# EasyEDA Pro project Simple Extension.epro

# Schematic Schematic1

## Sheets
1 P1: Board Name: Board1; Create Date: 2026-04-10; Page Name: P1; Project Name: Simple Extension; Schematic Name: Schematic1; Update Date: 2026-04-15; Company: EasyEDA.com; Page Size: A4; Version: V1.0
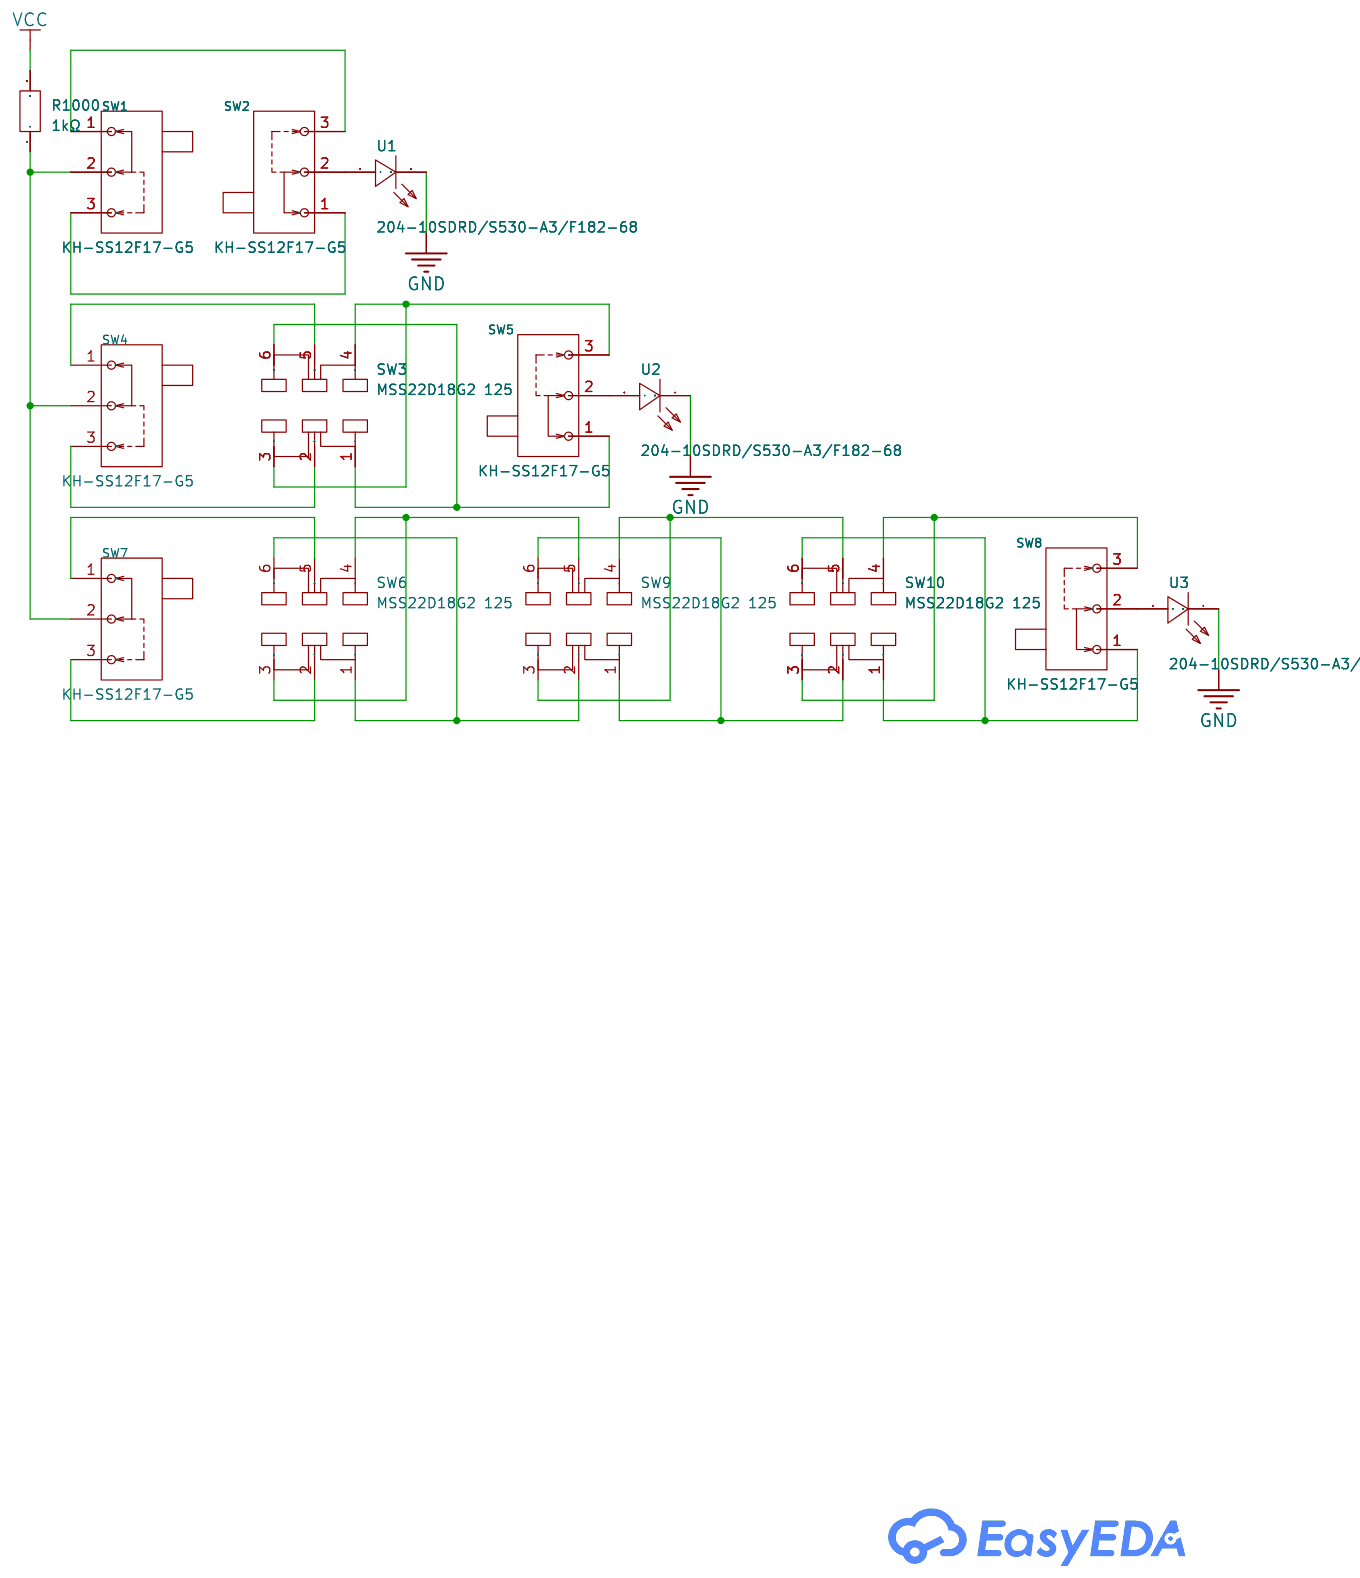
[diagram p0: P1]
2 P2: Page Name: P2; Update Date: 2026-04-11
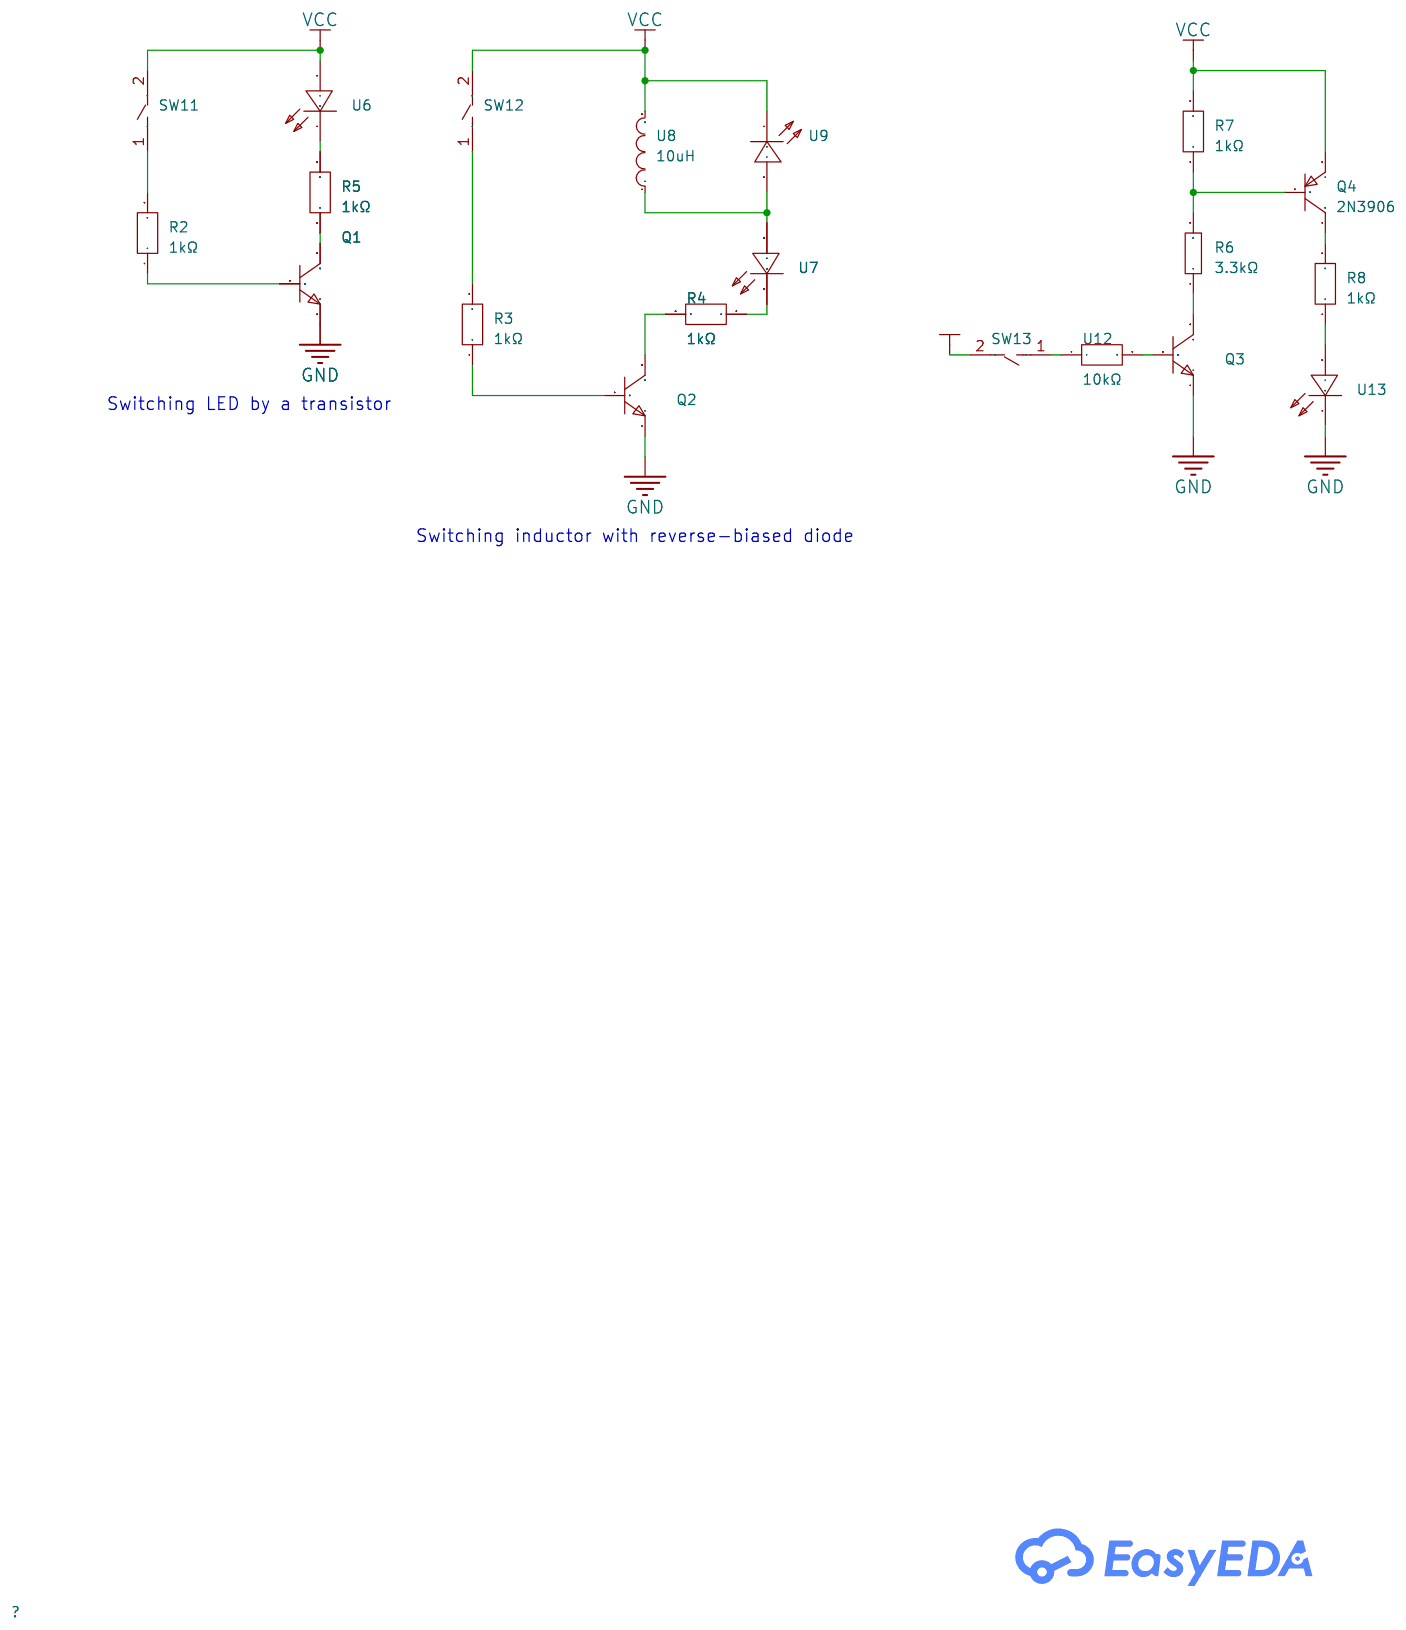
[diagram p1: P2]
3 Voltage I/O: Create Date: 2026-04-15; Page Name: Voltage I/O; Update Date: 2026-04-16
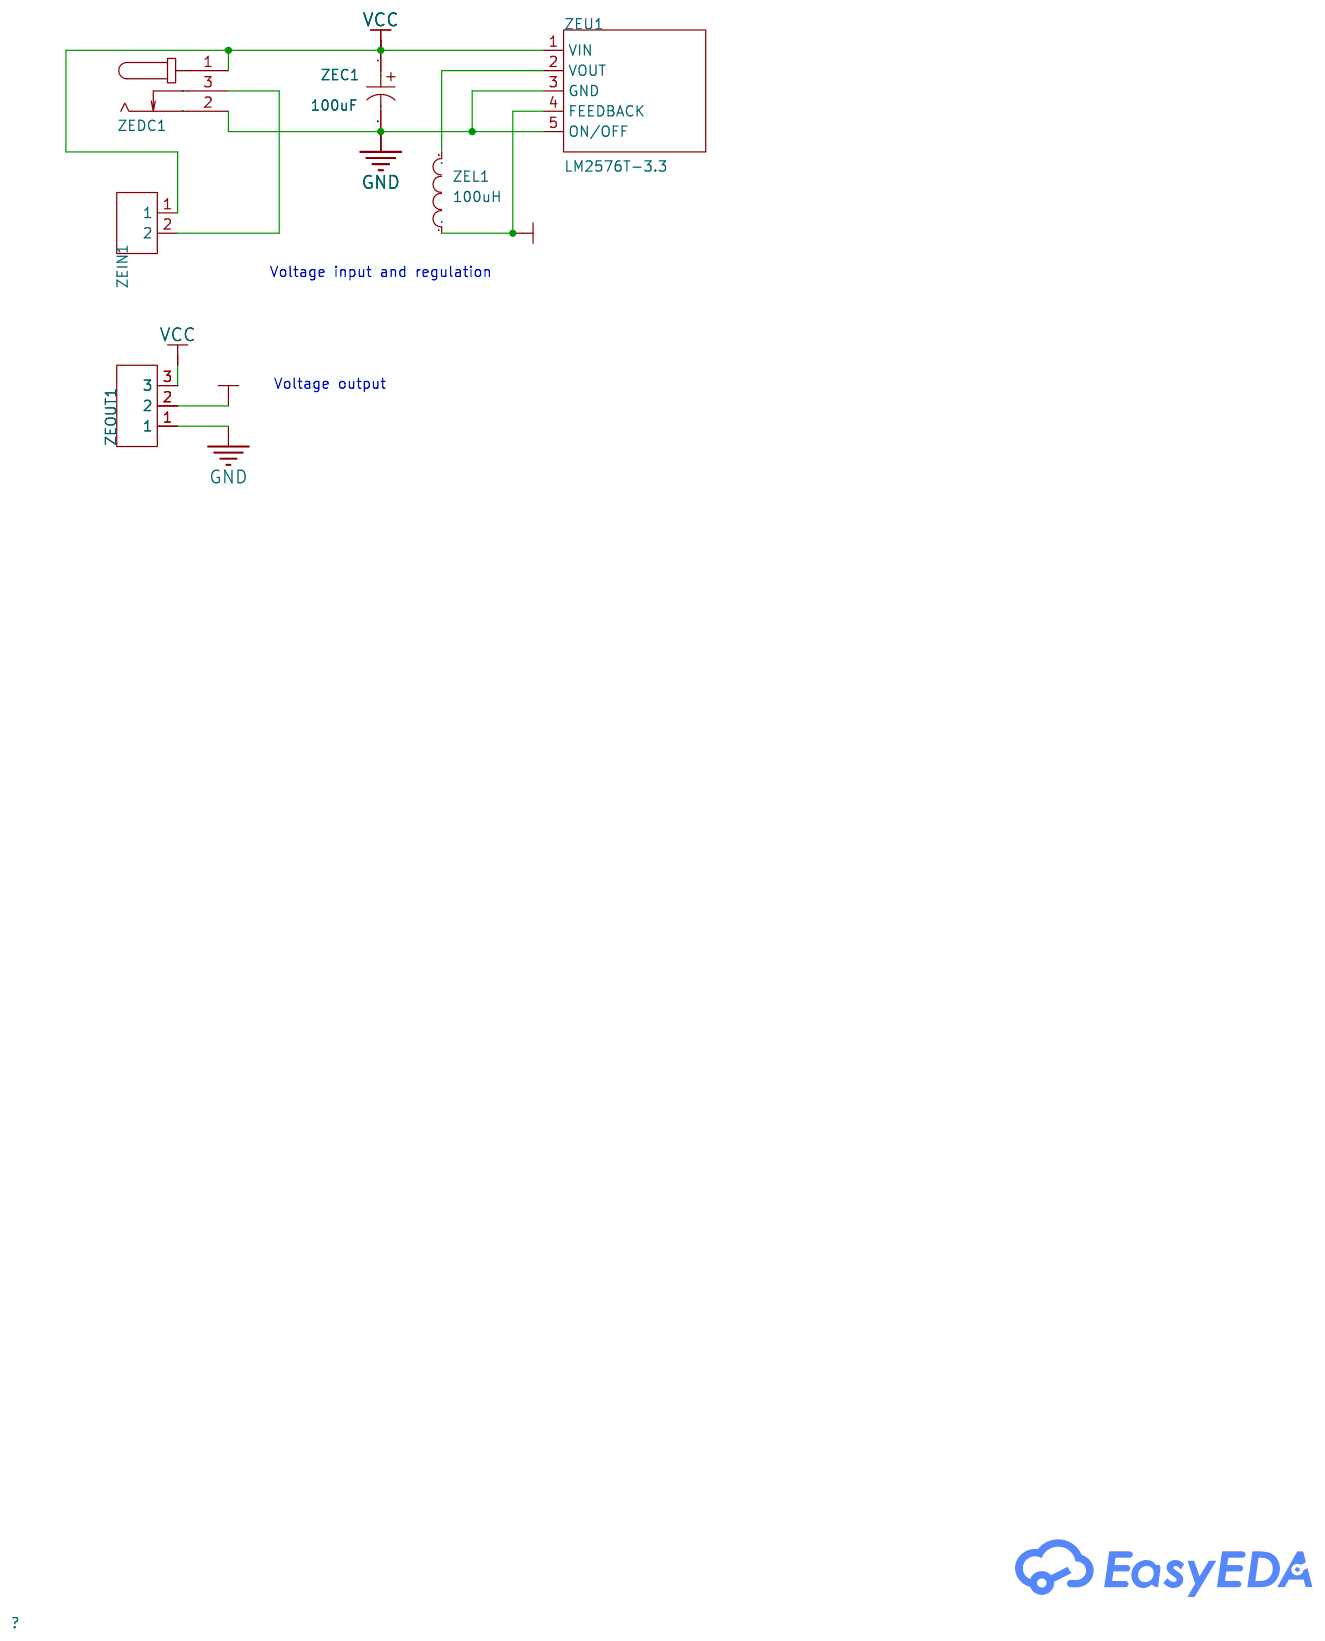
[diagram p2: Voltage I/O]
4 Resistance: Create Date: 2026-04-15; Page Name: Resistance; Update Date: 2026-04-16
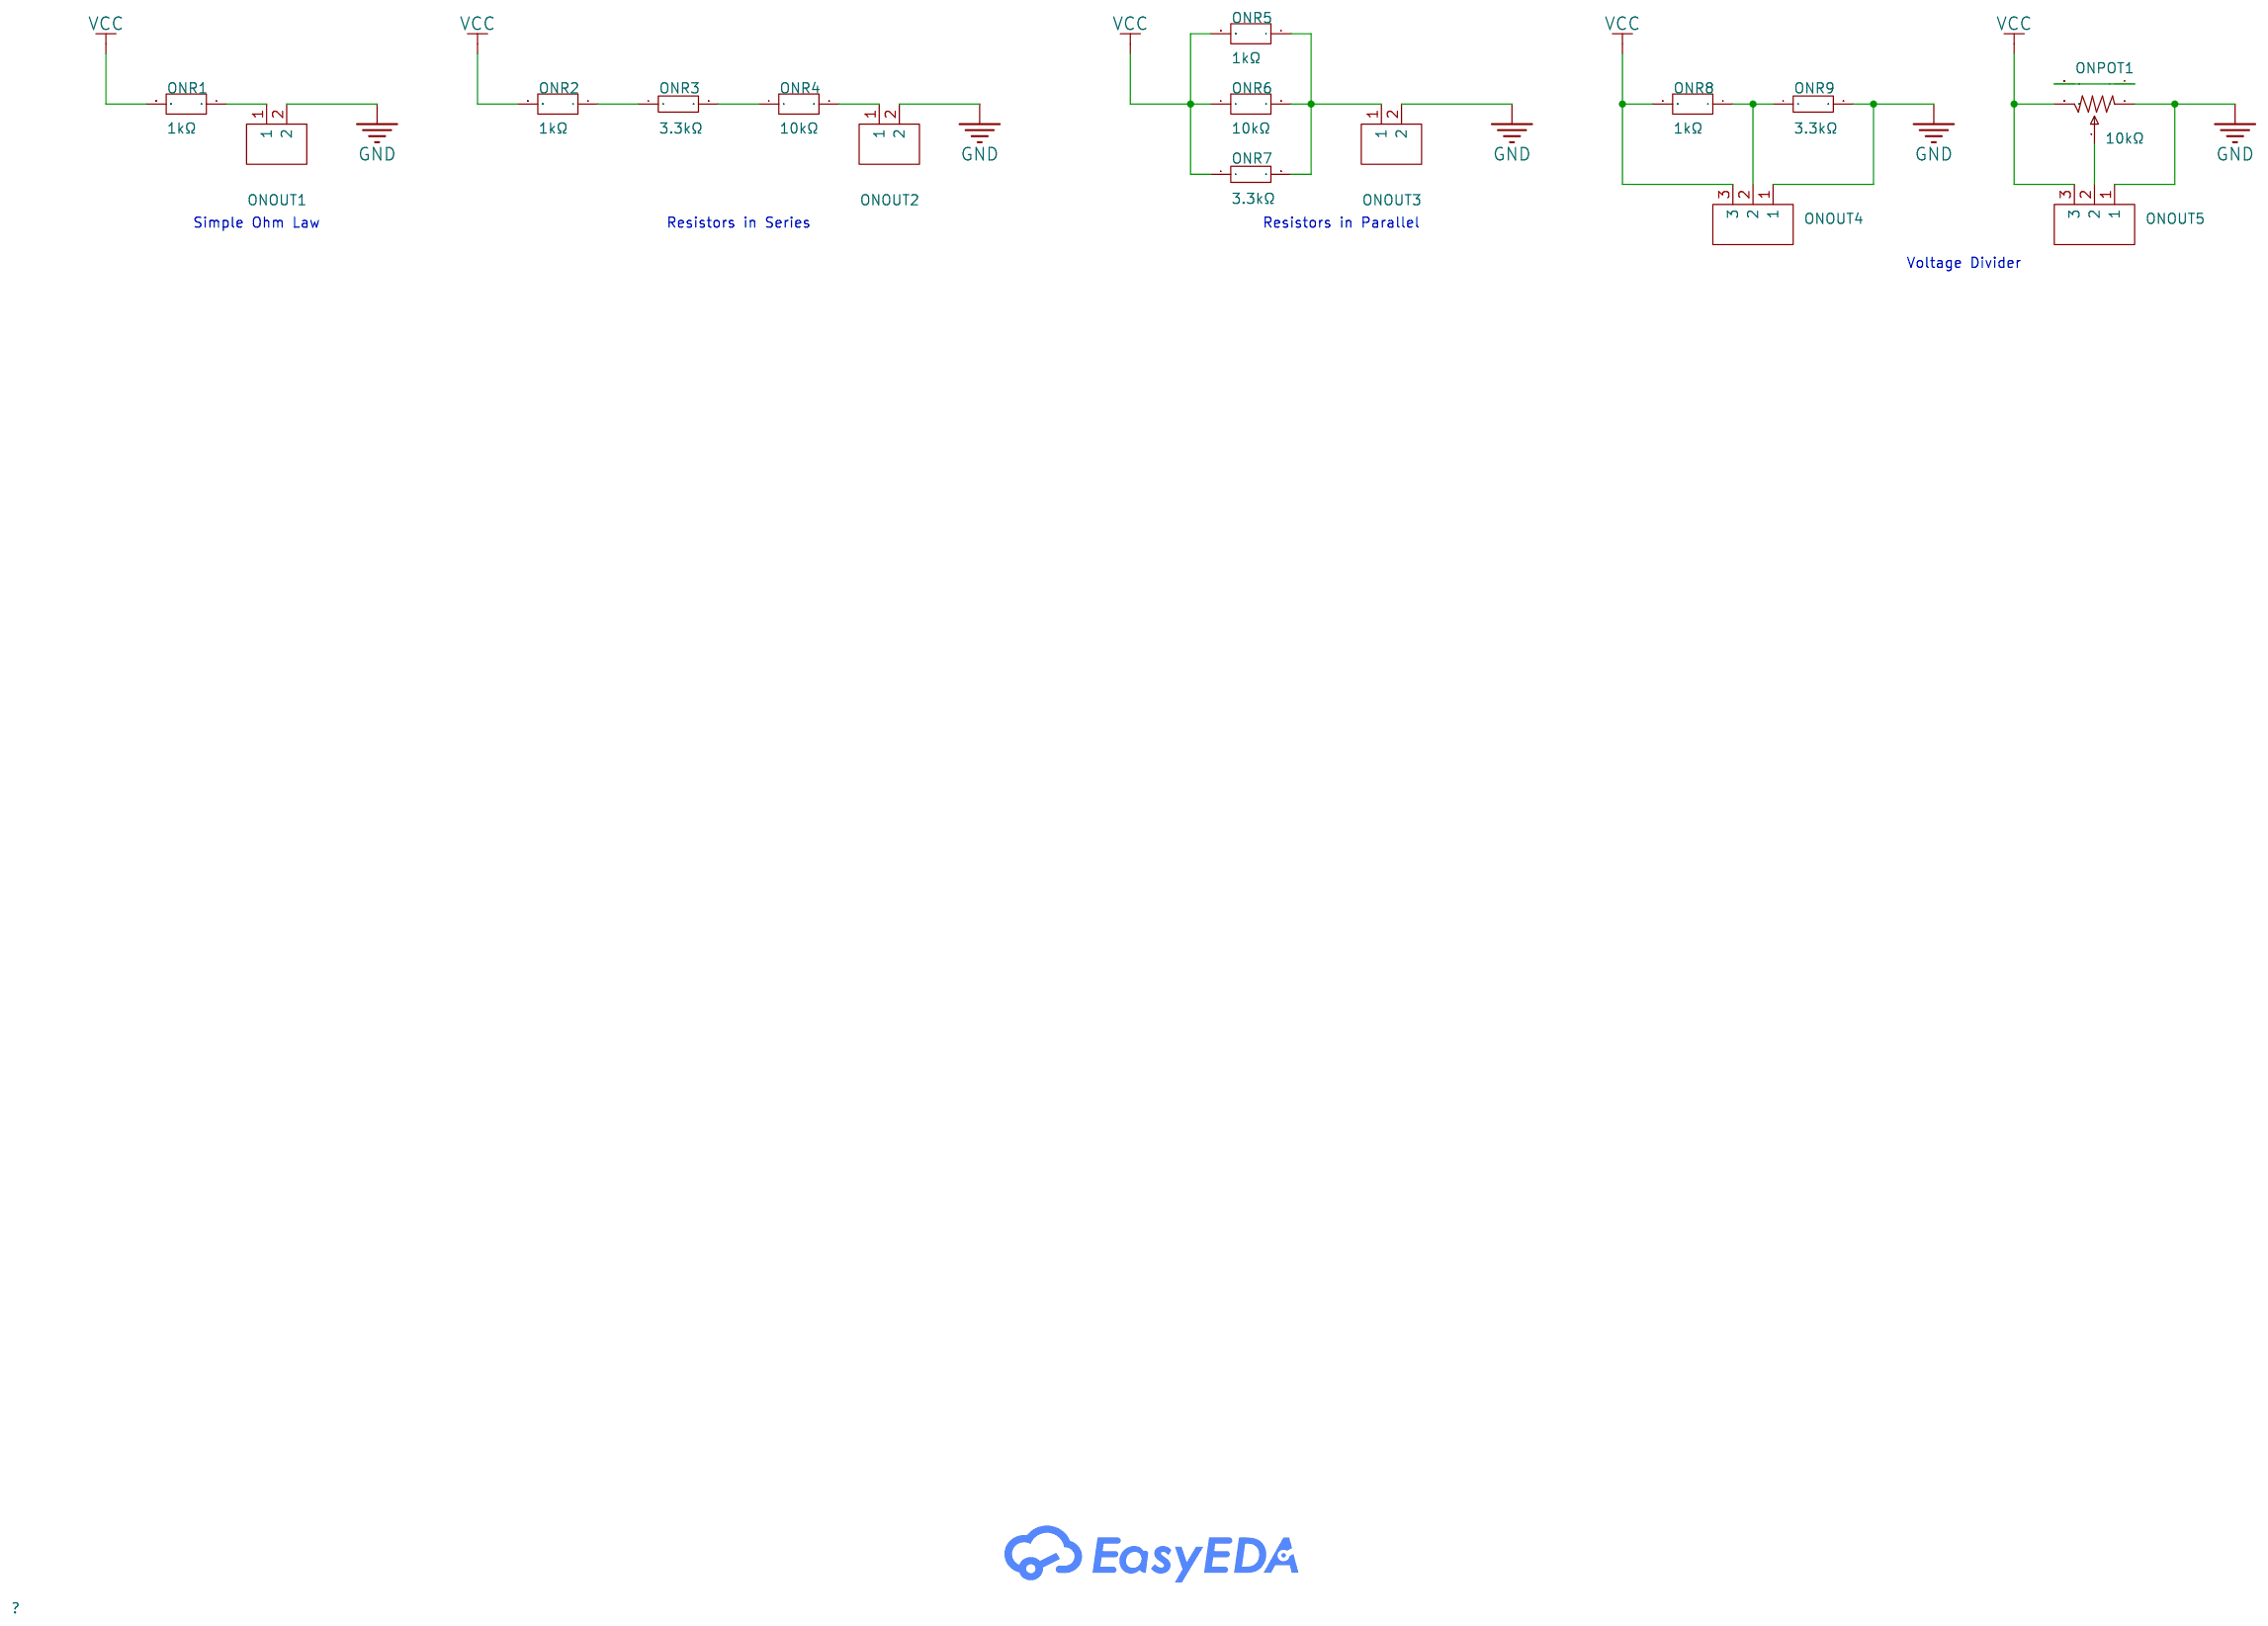
[diagram p3: Resistance]

## Parts
sheet P1
R1000  1kΩ  [RES-TH_BD2.3-L3.7-P7.70-D0.9]
SW1  KH-SS12F17-G5  [SW-TH_KH-SS12F17-G5]
SW2  KH-SS12F17-G5  [SW-TH_KH-SS12F17-G5]
SW3  MSS22D18G2 125  [SW-TH_SHOU_MSS22D18G2]
SW4  KH-SS12F17-G5  [SW-TH_KH-SS12F17-G5]
SW5  KH-SS12F17-G5  [SW-TH_KH-SS12F17-G5]
SW6  MSS22D18G2 125  [SW-TH_SHOU_MSS22D18G2]
SW7  KH-SS12F17-G5  [SW-TH_KH-SS12F17-G5]
SW8  KH-SS12F17-G5  [SW-TH_KH-SS12F17-G5]
SW9  MSS22D18G2 125  [SW-TH_SHOU_MSS22D18G2]
SW10  MSS22D18G2 125  [SW-TH_SHOU_MSS22D18G2]
U1  204-10SDRD/S530-A3/F182-68  [LED-TH_BD4.0-P2.50-RD]
U2  204-10SDRD/S530-A3/F182-68  [LED-TH_BD4.0-P2.50-RD]
U3  204-10SDRD/S530-A3/F182-68  [LED-TH_BD4.0-P2.50-RD]
sheet P2
Q1  2N4401052  [TO-92-3_L4.9-W3.7-P1.27-L]
Q2  2N4401052  [TO-92-3_L4.9-W3.7-P1.27-L]
Q3  2N4401052  [TO-92-3_L4.9-W3.7-P1.27-L]
Q4  2N3906  [TO-92-3_L4.8-W3.7-P1.27-R-1]
R2  1kΩ  [RES-TH_BD2.3-L3.7-P7.70-D0.9]
R3  1kΩ  [RES-TH_BD2.3-L3.7-P7.70-D0.9]
R4  1kΩ  [RES-TH_BD2.3-L3.7-P7.70-D0.9]
R5  1kΩ  [RES-TH_BD2.3-L3.7-P7.70-D0.9]
R6  3.3kΩ  [RES-TH_BD2.3-L6.5-P10.50-D0.5]
R7  1kΩ  [RES-TH_BD2.3-L3.7-P7.70-D0.9]
R8  1kΩ  [RES-TH_BD2.3-L3.7-P7.70-D0.9]
SW11  TSA36111-050D331DE  [SW-TH_L6.0-W3.5-P6.50]
SW12  TSA36111-050D331DE  [SW-TH_L6.0-W3.5-P6.50]
SW13  TSA36111-050D331DE  [SW-TH_L6.0-W3.5-P6.50]
U6  204-10SDRD/S530-A3/F182-68  [LED-TH_BD4.0-P2.50-RD]
U7  204-10SDRD/S530-A3/F182-68  [LED-TH_BD4.0-P2.50-RD]
U8  10uH  [IND-TH_BD4.0-L10.5-P14.50-D0.6]
U9  204-10SDRD/S530-A3/F182-68  [LED-TH_BD4.0-P2.50-RD]
U12  10kΩ  [RES-TH_BD2.3-L6.3-P10.30-D0.6]
U13  204-10SDRD/S530-A3/F182-68  [LED-TH_BD4.0-P2.50-RD]
sheet Resistance
ONOUT1  PH2.54-1X2P-H25  [HDR-TH_2P-P2.54-V-M-4]
ONOUT2  PH2.54-1X2P-H25  [HDR-TH_2P-P2.54-V-M-4]
ONOUT3  PH2.54-1X2P-H25  [HDR-TH_2P-P2.54-V-M-4]
ONOUT4  PH2.54-01-03PZD  [HDR-TH_3P-P2.54-V-M]
ONOUT5  PH2.54-01-03PZD  [HDR-TH_3P-P2.54-V-M]
ONPOT1  10kΩ  [RES-ADJ-TH_RK09D1130C3C]
ONR1  1kΩ  [RES-TH_BD2.3-L3.7-P7.70-D0.9]
ONR2  1kΩ  [RES-TH_BD2.3-L3.7-P7.70-D0.9]
ONR3  3.3kΩ  [RES-TH_BD2.3-L6.5-P10.50-D0.5]
ONR4  10kΩ  [RES-TH_BD2.3-L6.3-P10.30-D0.6]
ONR5  1kΩ  [RES-TH_BD2.3-L3.7-P7.70-D0.9]
ONR6  10kΩ  [RES-TH_BD2.3-L6.3-P10.30-D0.6]
ONR7  3.3kΩ  [RES-TH_BD2.3-L6.5-P10.50-D0.5]
ONR8  1kΩ  [RES-TH_BD2.3-L3.7-P7.70-D0.9]
ONR9  3.3kΩ  [RES-TH_BD2.3-L6.5-P10.50-D0.5]
sheet Voltage I/O
ZEC1  100uF  [CAP-TH_BD6.0-P2.50-D0.5-FD]
ZEDC1  DC-005-2.5  [DC-IN-TH_DC-005-2.5_C9900097950]
ZEIN1  PH2.54-1X2P-H25  [HDR-TH_2P-P2.54-V-M-4]
ZEL1  100uH  [IND-TH_BD4.0-L11.0-P15.00-D0.6]
ZEOUT1  PH2.54-01-03PZD  [HDR-TH_3P-P2.54-V-M]
ZEU1  LM2576T-3.3  [TO-220-5L_L10.2-W4.5-P1.71-L]

## Library data of the parts
ONR1 ONR2 ONR5 ONR8 R2-R5 R7 R8 R1000 = CR1/8W-1K±5%-OT26: Type:Carbon Resister Resistance: Tolerance:±5% Tolerance:±5% Overload Voltage (Max):200V Power(Watts):125mW Temperature Coefficient:±350ppm/℃ Temperature Coefficient:±350ppm/℃ Operating Temperature Range:-55℃~+155℃ Operating Temperature Range:-55℃~+155℃; LCSC Part Name: 碳膜电阻 1kΩ ±5% 125mW; Supplier Part: C2896952; Manufacturer: VO(翔胜); Supplier Footprint: 插件,D2.3xL3.7mm; JLCPCB Part Class: Extended Part; Datasheet: https://atta.szlcsc.com/upload/public/pdf/source/20210803/C2857407_45FF53FE186CAB545115AD37303966CD.pdf; Supplier: LCSC; Type: Carbon Resister; Tolerance: ±5%; Overload Voltage (Max): 200V; Power(Watts): 125mW; Temperature Coefficient: ±350ppm/℃; Operating Temperature Range: -55℃~+155℃
SW1 SW2 SW4 SW5 SW7 SW8 = KH-SS12F17-G5: LCSC Part Name: 拨动开关 KH-SS12F17-G5; Supplier Part: C5274464; Manufacturer: kinghelm(金航标); Supplier Footprint: 插件; JLCPCB Part Class: Extended Part; Datasheet: https://atta.szlcsc.com/upload/public/pdf/source/20221118/A394A3D39A10FBA52FA26B90A9AAE8C2.pdf; Supplier: LCSC
SW3 SW6 SW9 SW10 = MSS22D18G2 125: Circuit:DPDT Termination Style:PC Pin Mounting Type:Through Hole Actuator Color:Black Current Rating:100mA Voltage Rating:12V Life:10,000 cycles Operating Temperature:-25℃~+70℃ Operating Temperature:-25℃~+70℃; LCSC Part Name: MSS-22D18G2; Supplier Part: C2906278; Manufacturer: SHOU HAN(首韩); Supplier Footprint: 插件; JLCPCB Part Class: Extended Part; Datasheet: https://item.szlcsc.com/datasheet/MSS22D18G2%2520125/3178988.html; Supplier: LCSC; Circuit: DPDT; Termination Style: PC Pin; Mounting Type: Through Hole; Actuator Color: Black; Current Rating: 100mA; Voltage Rating: 12V; Life: 10,000 cycles; Operating Temperature: -25℃~+70℃
U1-U3 U6 U7 U9 U13 = 204-10SDRD/S530-A3/F182-68: Supplier Part: C473831; Manufacturer: EVERLIGHT(亿光); Supplier Footprint: 插件; JLCPCB Part Class: Extended Part; Supplier: LCSC
Q1-Q3 = 2N4401052: type:NPN Current - Collector(Ic):600mA Collector - Emitter Voltage VCEO:40V Pd - Power Dissipation:1.5W DC Current Gain:300@150mA,1V DC Current Gain:300@150mA,1V Transition frequency(fT):250MHz Current - Collector Cutoff:100nA Vce Saturation(VCE(sat)):750; LCSC Part Name: 电流:600mA 电压:40V; Supplier Part: C22751480; Manufacturer: ALJ(龙晶微); Supplier Footprint: TO-92; JLCPCB Part Class: Extended Part; Datasheet: https://item.szlcsc.com/datasheet/2N4401052/24477133.html; Supplier: LCSC; type: NPN; Current - Collector(Ic): 600mA; Collector - Emitter Voltage VCEO: 40V; Pd - Power Dissipation: 1.5W; DC Current Gain: 300@150mA,1V; Transition frequency(fT): 250MHz; Current - Collector Cutoff: 100nA; Vce Saturation(VCE(sat)): 750mV@500mA,50mA; Operating Temperature: -55℃~+150℃; Emitter-Base Voltage(Vebo): 6V
Q4 = 2N3906_C2980868: type:PNP Current - Collector(Ic):200mA Collector - Emitter Voltage VCEO:40V Pd - Power Dissipation:625mW DC Current Gain:100@10mA,1V DC Current Gain:100@10mA,1V Transition frequency(fT):250MHz Current - Collector Cutoff:100nA Vce Saturation(VCE(sat)):400m; LCSC Part Name: PNP 电流:200mA 电压:40V; Supplier Part: C2980868; Manufacturer: Slkor(萨科微); Supplier Footprint: TO-92; JLCPCB Part Class: Extended Part; Datasheet: https://item.szlcsc.com/datasheet/2N3906/3404387.html; Supplier: LCSC; type: PNP; Current - Collector(Ic): 200mA; Collector - Emitter Voltage VCEO: 40V; Pd - Power Dissipation: 625mW; DC Current Gain: 100@10mA,1V; Transition frequency(fT): 250MHz; Current - Collector Cutoff: 100nA; Vce Saturation(VCE(sat)): 400mV@50mA,5mA; Emitter-Base Voltage(Vebo): 5V; Number: 1 PNP
ONR3 ONR7 ONR9 R6 = MF1/4W-3.3KΩ±1% T: Type:Metal Film Resistors Resistance: Tolerance:±1% Tolerance:±1% Voltage-Supply(Max):250V Power(Watts):250mW Temperature Coefficient:±100ppm/℃ Temperature Coefficient:±100ppm/℃ Operating Temperature:-55℃~+155℃ Operating Temperature:-55℃~+155℃; LCSC Part Name: 3.3kΩ ±1% 250mW 金属膜电阻; Supplier Part: C119335; Manufacturer: CCO(千志电子); Supplier Footprint: 插件,D2.3xL6.5mm; JLCPCB Part Class: Extended Part; Datasheet: https://atta.szlcsc.com/upload/public/pdf/source/20190910/C427326_62A6D058BC0FF74963A2F22379CA06CE.pdf; Supplier: LCSC; Type: Metal Film Resistors; Tolerance: ±1%; Voltage-Supply(Max): 250V; Power(Watts): 250mW; Temperature Coefficient: ±100ppm/℃; Operating Temperature: -55℃~+155℃
SW11-SW13 = TSA36111-050D331DE: Circuit:SPST Actuator Style:Rectangular Button Mounting Type:Through Hole Length:6mm Width:3.5mm Switch Height:5mm with Bracket:Without Bracket Contact Current:50mA Voltage Rating:12V With Lamp:No Termination Style:PC Pin Operating Temperature:-25℃~+70℃ O; LCSC Part Name: 6mm 3.5mm 5mm 12V 50mA; Supplier Part: C50395964; Manufacturer: Khon(康宏电子); Supplier Footprint: 插件; JLCPCB Part Class: Extended Part; Datasheet: https://item.szlcsc.com/datasheet/TSA36111-050D331DE/53018952.html; Supplier: LCSC; Circuit: SPST; Actuator Style: Rectangular Button; Mounting Type: Through Hole; Length: 6mm; Width: 3.5mm; Switch Height: 5mm; with Bracket: Without Bracket; Contact Current: 50mA; Voltage Rating: 12V; With Lamp: No; Termination Style: PC Pin; Operating Temperature: -25℃~+70℃
U8 = LGA0410-100KP52E-CP: Inductance:10uH Tolerance:±10% Tolerance:±10% Current Rating:500mA DC Resistance(DCR):580mΩ Type:Color Band Inductor Q @ Frequency:65@7.96MHz Frequency - Self Resonant:21MHz Wire Diameter:0.6mm; LCSC Part Name: LGA型色码电感器; Supplier Part: C5120064; Manufacturer: FH(风华); Supplier Footprint: 插件; JLCPCB Part Class: Extended Part; Datasheet: https://item.szlcsc.com/datasheet/LGA0410-100KP52E-CP/5703713.html; Supplier: LCSC; Tolerance: ±10%; Current Rating: 500mA; DC Resistance(DCR): 580mΩ; Type: Color Band Inductor; Q @ Frequency: 65@7.96MHz; Frequency - Self Resonant: 21MHz; Wire Diameter: 0.6mm
ONR4 ONR6 U12 = LR1F10K: Type:Metal Film Resistor Resistance:10kΩ Tolerance:±1% Tolerance:±1% Power(Watts):600mW Temperature Coefficient:±50ppm/℃ Temperature Coefficient:±50ppm/℃ Operating Temperature:-55℃~+155℃ Operating Temperature:-55℃~+155℃; LCSC Part Name: 金属膜电阻 10kΩ ±1% 600mW; Supplier Part: C1367502; Manufacturer: TE Connectivity(泰科电子); Supplier Footprint: 插件; JLCPCB Part Class: Extended Part; Datasheet: https://item.szlcsc.com/datasheet/LR1F10K/1457791.html; Supplier: LCSC; Type: Metal Film Resistor; Tolerance: ±1%; Power(Watts): 600mW; Temperature Coefficient: ±50ppm/℃; Operating Temperature: -55℃~+155℃
ONOUT1-ONOUT3 ZEIN1 = PH2.54-1X2P-H25: Pin Structure:1x2P Pitch:2.54mm Row Spacing:- Circluar Pins/Square Pins:Pin Header Mounting Type:Through Hole Number of Rows:1 Number of Pins:2P Current Rating:3A Voltage Rating (Max):- Length of Mating Pin:6mm Insulation Height:2.5mm Length of End Connec; LCSC Part Name: 1x2P 间距:2.54mm 方针 直插; Supplier Part: C42431798; Manufacturer: JXTCONN(聚兴泰); Supplier Footprint: 插件,P=2.54mm; JLCPCB Part Class: Extended Part; Datasheet: https://item.szlcsc.com/datasheet/PH2.54-1X2P-H25/44458928.html; Supplier: LCSC; Pin Structure: 1x2P; Pitch: 2.54mm; Circluar Pins/Square Pins: Pin Header; Mounting Type: Through Hole; Number of Rows: 1; Number of Pins: 2P; Current Rating: 3A; Length of Mating Pin: 6mm; Insulation Height: 2.5mm; Length of End Connection Pin: 3mm; Contact Material: Brass; Contact Plating: Gold; Operating Temperature: -40℃~+105℃; Color: Black
ONOUT4 ONOUT5 ZEOUT1 = PH2.54-01-03PZD: Pin Structure:1x3P Pitch:2.54mm Circluar Pins/Square Pins:Policy Mounting Type:Straight Number of Rows:Single Row Number of Pins:3P Length of Mating Pin:6mm Insulation Height:2.5mm Length of End Connection Pin:3mm Contact Material:Brass Operating Temperat; LCSC Part Name: 1x3P 间距:2.54mm 方针 直插; Supplier Part: C7501581; Manufacturer: XUNPU(讯普); Supplier Footprint: 插件,P=2.54mm; JLCPCB Part Class: Extended Part; Datasheet: https://atta.szlcsc.com/upload/public/pdf/source/20230815/30A24B1E4B9BDE2239C7F8E56770F33B.pdf; Supplier: LCSC; Pin Structure: 1x3P; Pitch: 2.54mm; Circluar Pins/Square Pins: Policy; Mounting Type: Straight; Number of Rows: Single Row; Number of Pins: 3P; Length of Mating Pin: 6mm; Insulation Height: 2.5mm; Length of End Connection Pin: 3mm; Contact Material: Brass; Operating Temperature: -40℃~+105℃; Color: Black
ONPOT1 = RK09D1130C1B: Resistance:10kΩ Tolerance:±20% Tolerance:±20% Voltage Rating:20V Power(Watts):50mW Number of Turns:-; LCSC Part Name: 10kΩ ±20%; Supplier Part: C470304; Manufacturer: ALPSALPINE(阿尔卑斯阿尔派); Supplier Footprint: 插件; JLCPCB Part Class: Extended Part; Datasheet: https://atta.szlcsc.com/upload/public/pdf/source/20191216/C470452_A95F493F84F2A4E5D2456A617FF6269D.pdf; Supplier: LCSC; Tolerance: ±20%; Voltage Rating: 20V; Power(Watts): 50mW
ZEC1 = KM1E101M0611: Capacitance:100uF Tolerance:±20% Tolerance:±20% Voltage Rating:25V Ripple Current:142mA@120kHz Equivalent Series Resistance(ESR):- Pin Spacing:2.5mm Diameter:- Height - Seated (Max):- Lifetime:2000hrs@105℃ Operating Temperature:-40℃~+105℃ Operating Temper; LCSC Part Name: 100uF ±20% 25V; Supplier Part: C2873969; Manufacturer: ROQANG(容强); Supplier Footprint: 插件; JLCPCB Part Class: Extended Part; Datasheet: https://item.szlcsc.com/datasheet/KM1E101M0611/3078452.html; Supplier: LCSC; Tolerance: ±20%; Voltage Rating: 25V; Ripple Current: 142mA@120kHz; Pin Spacing: 2.5mm; Lifetime: 2000hrs@105℃; Operating Temperature: -40℃~+105℃
ZEDC1 = DC-005-2.5: Connector Type:DC Power Jack Mounting Type:Right Angle Inside Contact Diameter:2.5mm Outside Contact Diameter:6.3mm Current Rating:3A Voltage Rating (Max):20V; LCSC Part Name: DC电源插座 内径:2.5mm 外径:6.3mm; Supplier Part: C22459639; Manufacturer: HanElectricity(瀚源); Supplier Footprint: 插件; JLCPCB Part Class: Extended Part; Datasheet: https://item.szlcsc.com/datasheet/DC-005-2.5/24136245.html; Supplier: LCSC; Connector Type: DC Power Jack; Mounting Type: Right Angle; Inside Contact Diameter: 2.5mm; Outside Contact Diameter: 6.3mm; Current Rating: 3A; Voltage Rating (Max): 20V
ZEL1 = YAL0410-101K: Inductance:100uH Tolerance:±10% Tolerance:±10% Current Rating:275mA Current - Saturation(Isat):- DC Resistance(DCR):2.5Ω Type:Color Band Inductor Q @ Frequency:30@2.52MHz Frequency - Self Resonant:4.8MHz Ratings:-; LCSC Part Name: 100uH ±10% 色环电感; Supplier Part: C2931858; Manufacturer: YJYCOIN(益嘉源); Supplier Footprint: 插件,D4xL11mm; JLCPCB Part Class: Extended Part; Datasheet: https://item.szlcsc.com/datasheet/YAL0410-101K/3273587.html; Supplier: LCSC; Tolerance: ±10%; Current Rating: 275mA; DC Resistance(DCR): 2.5Ω; Type: Color Band Inductor; Q @ Frequency: 30@2.52MHz; Frequency - Self Resonant: 4.8MHz
ZEU1 = LM2576T-3.3: Function:Buck Voltage - Supply:40V Voltage - Supply:40V Output Voltage:3.3V Output Voltage:3.3V Output Current:3A Frequency - Switching:52kHz Frequency - Switching:52kHz Operating Temperature:-40℃~+125℃ Operating Temperature:-40℃~+125℃ Synchronous Rectifi; LCSC Part Name: 降压型 3A 40V; Supplier Part: C596343; Manufacturer: HTC; Supplier Footprint: TO-220-5; JLCPCB Part Class: Extended Part; Datasheet: https://item.szlcsc.com/datasheet/LM2576T-3.3/624387.html; Supplier: LCSC; Function: Buck; Voltage - Supply: 40V; Output Voltage: 3.3V; Output Current: 3A; Frequency - Switching: 52kHz; Operating Temperature: -40℃~+125℃; Synchronous Rectifier: No; Number of Outputs: 1; Topology: Buck; Quiescent Current: 5mA; Switch tube (built-in/external): Built-in; Output Type: Fixed

## Nets
3.3V: SW13.2 ZEL1.1 ZEOUT1.2 ZEU1.4(FEEDBACK)
GND: ONOUT1.2 ONOUT2.2 ONOUT3.2 ONOUT4.1 ONOUT5.1 ONPOT1.1 ONR9.2 Q1.1(E) Q2.1(E) Q3.1(E) U1.1(C) U2.1(C) U3.1(C) U13.1(C) ZEC1.2 ZEDC1.2 ZEOUT1.1 ZEU1.3(GND) ZEU1.5(ON/OFF)
VCC: ONOUT4.3 ONOUT5.3 ONPOT1.3 ONR1.2 ONR2.2 ONR5.2 ONR6.1 ONR7.1 ONR8.2 Q4.3(E) R7.2 R1000.2 SW11.2 SW12.2 U6.2(A) U8.2 U9.1(C) ZEC1.1 ZEDC1.1 ZEIN1.1 ZEOUT1.3 ZEU1.1(VIN)
$1N365: R1000.1 SW1.2 SW4.2 SW7.2
$1N377: SW1.3 SW2.1
$1N384: SW2.2 U1.2(A)
$1N786: SW3.5 SW4.1
$1N793: SW3.2 SW4.3
$1N800: SW3.3 SW3.4 SW5.3
$1N813: SW3.1 SW3.6 SW5.1
$1N922: SW5.2 U2.2(A)
$1N1430: SW6.3 SW6.4 SW9.5
$1N1432: SW6.5 SW7.1
$1N1434: SW6.2 SW7.3
$1N1525: SW8.2 U3.2(A)
$1N1578: SW6.1 SW6.6 SW9.2
$1N1579: SW9.3 SW9.4 SW10.5
$1N1580: SW9.1 SW9.6 SW10.2
$1N1671: SW8.1 SW10.1 SW10.6
$1N1675: SW8.3 SW10.3 SW10.4
$1N5046: SW1.1 SW2.3
$2N461: R2.2 SW11.1
$2N474: Q1.2(B) R2.1
$2N1113: R3.2 SW12.1
$2N1115: Q2.2(B) R3.1
$2N1315: U7.2(A) U8.1 U9.2(A)
$2N1340: Q2.3(C) R4.2
$2N1343: R4.1 U7.1(C)
$2N1440: R5.2 U6.1(C)
$2N1444: Q1.3(C) R5.1
$2N1540: SW13.1 U12.1
$2N1731: Q3.2(B) U12.2
$2N1811: Q3.3(C) R6.1
$2N1868: Q4.2(B) R6.2 R7.1
$2N2553: Q4.1(C) R8.2
$2N2641: R8.1 U13.2(A)
$3N305: ZEL1.2 ZEU1.2(VOUT)
$3N525: ZEDC1.3 ZEIN1.2
$4N194: ONOUT1.1 ONR1.1
$4N663: ONR2.1 ONR3.1
$4N899: ONOUT3.1 ONR5.1 ONR6.2 ONR7.2
$4N954: ONR3.2 ONR4.1
$4N958: ONOUT2.1 ONR4.2
$4N1176: ONOUT4.2 ONR8.1 ONR9.1
$4N1400: ONOUT5.2 ONPOT1.2
Net-(ONPOT1-4): ONPOT1.4 ONPOT1.5

## Notes on the sheets
sheet 2
- Switching LED by a transistor
- Switching inductor with reverse-biased diode
sheet 3
- Voltage input and regulation
- Voltage output
sheet 4
- Simple Ohm Law
- Resistors in Series
- Resistors in Parallel
- Voltage Divider

# Board PCB1
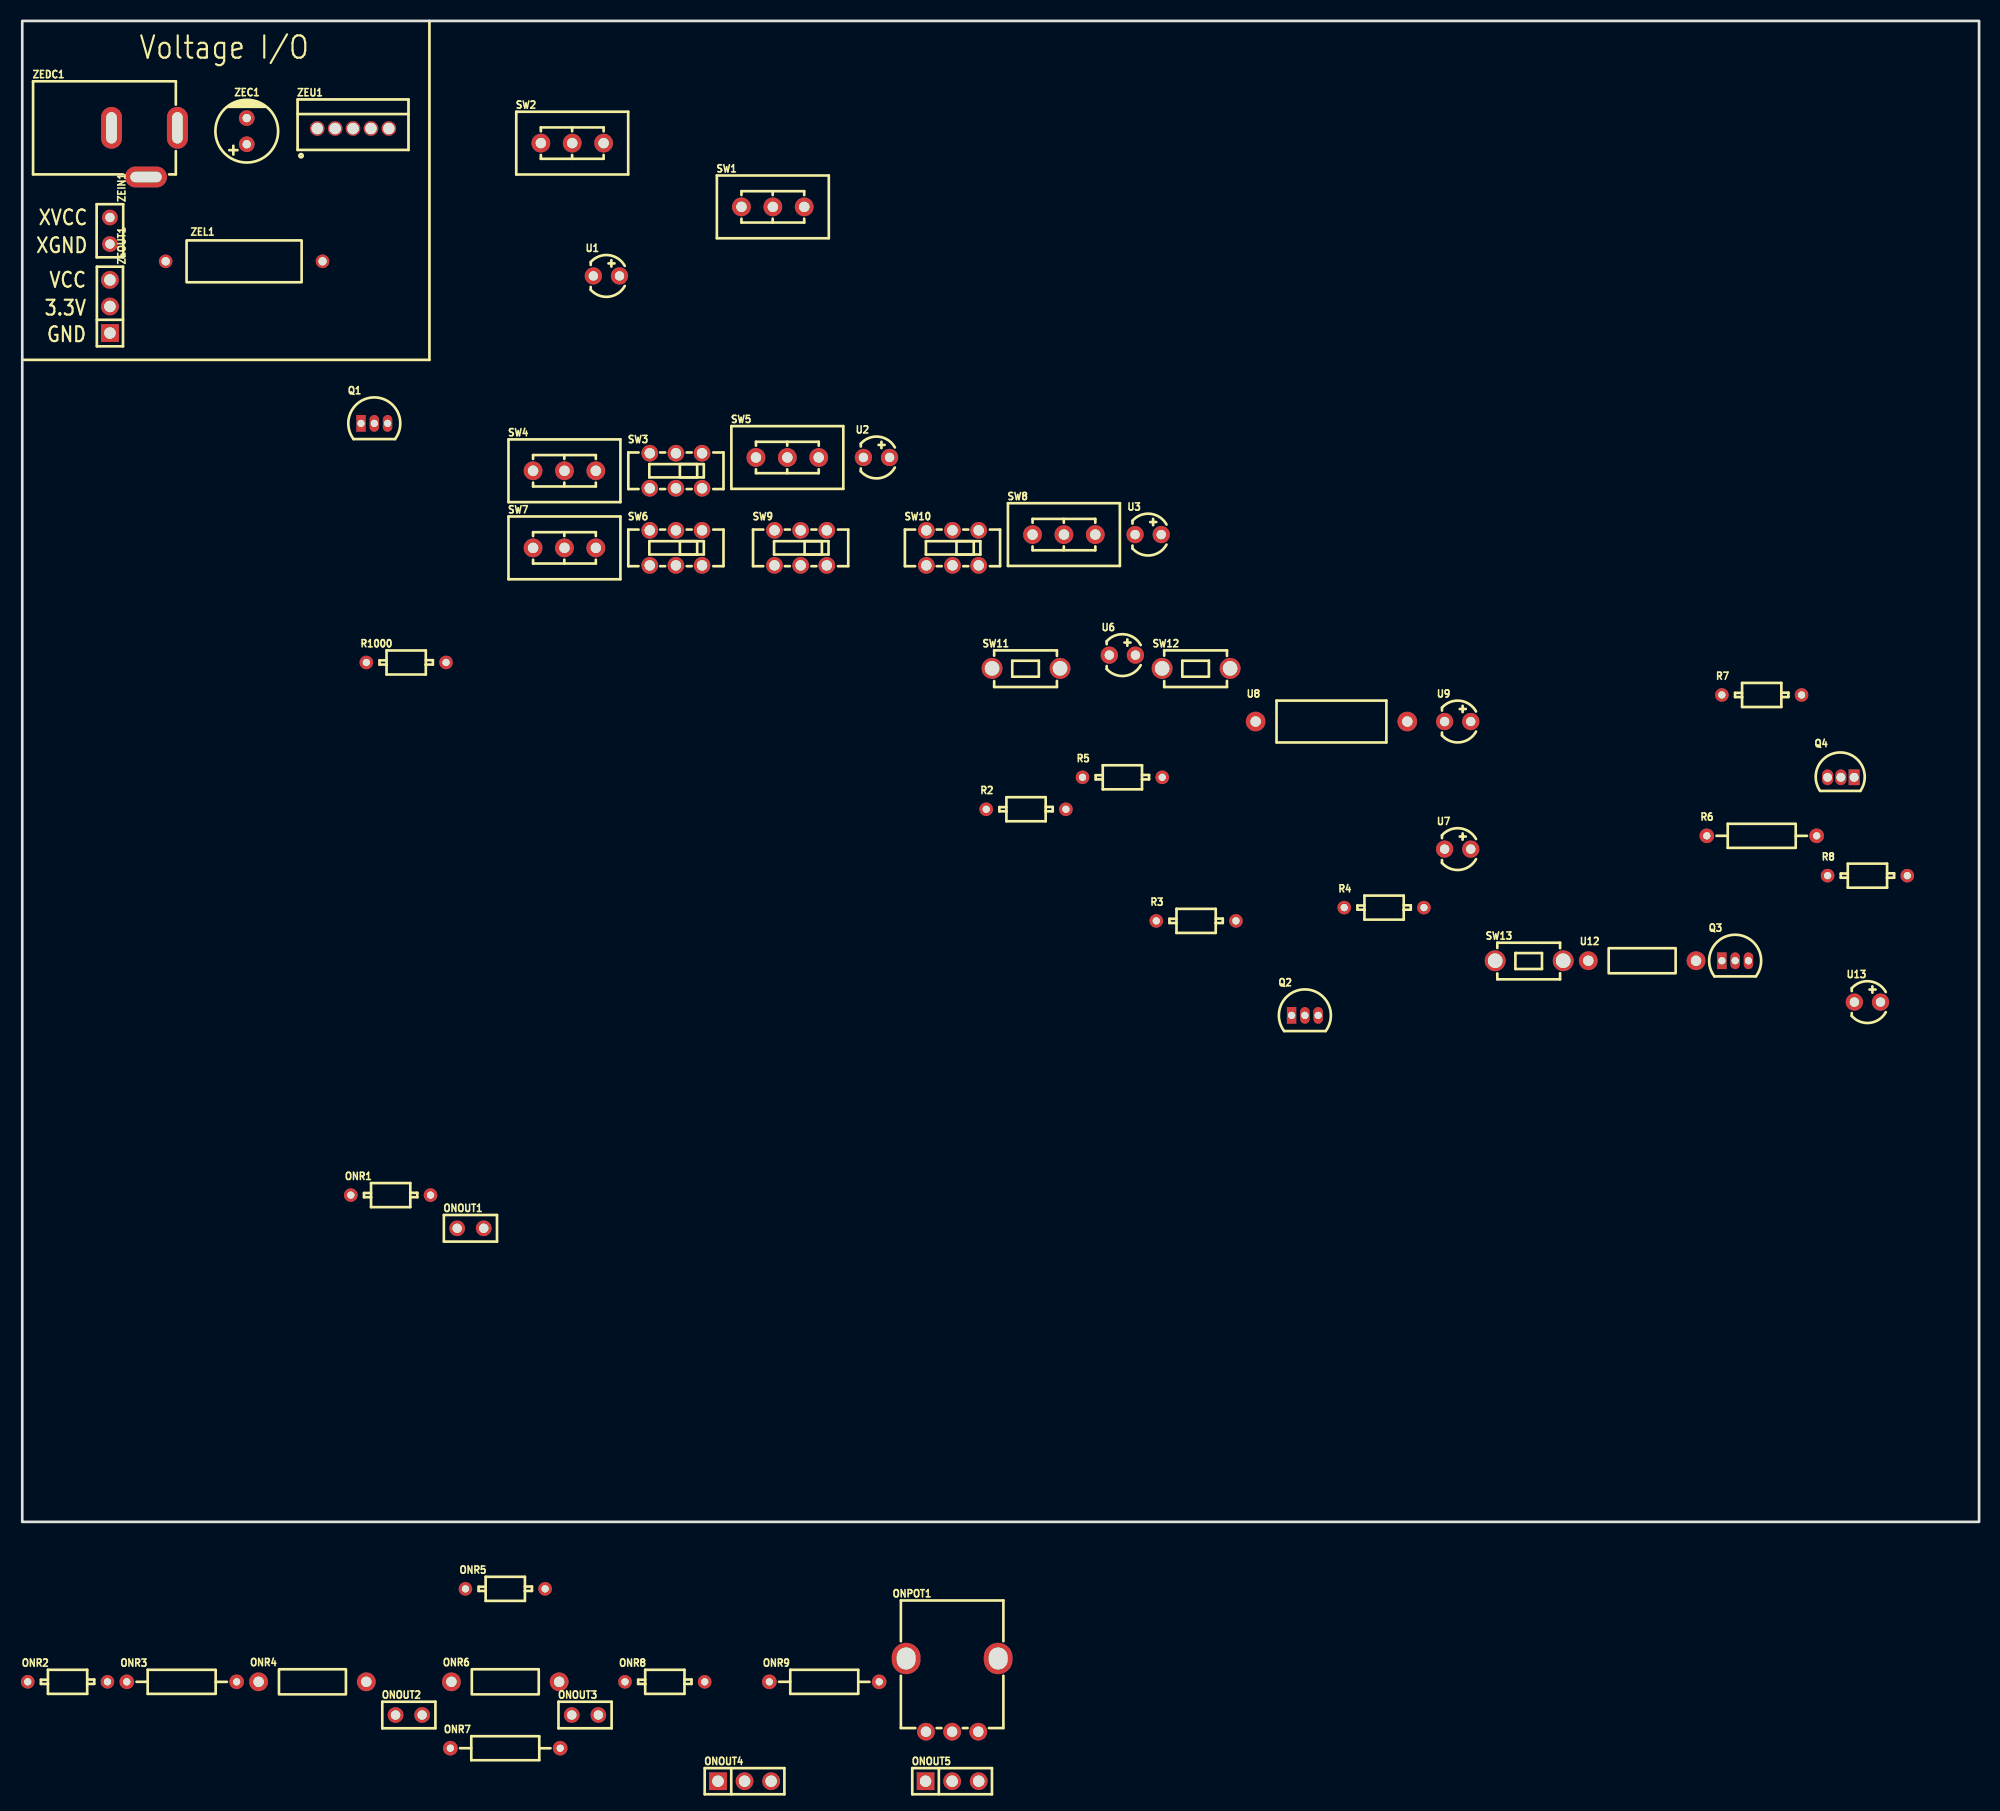
[diagram p4: board, top side]
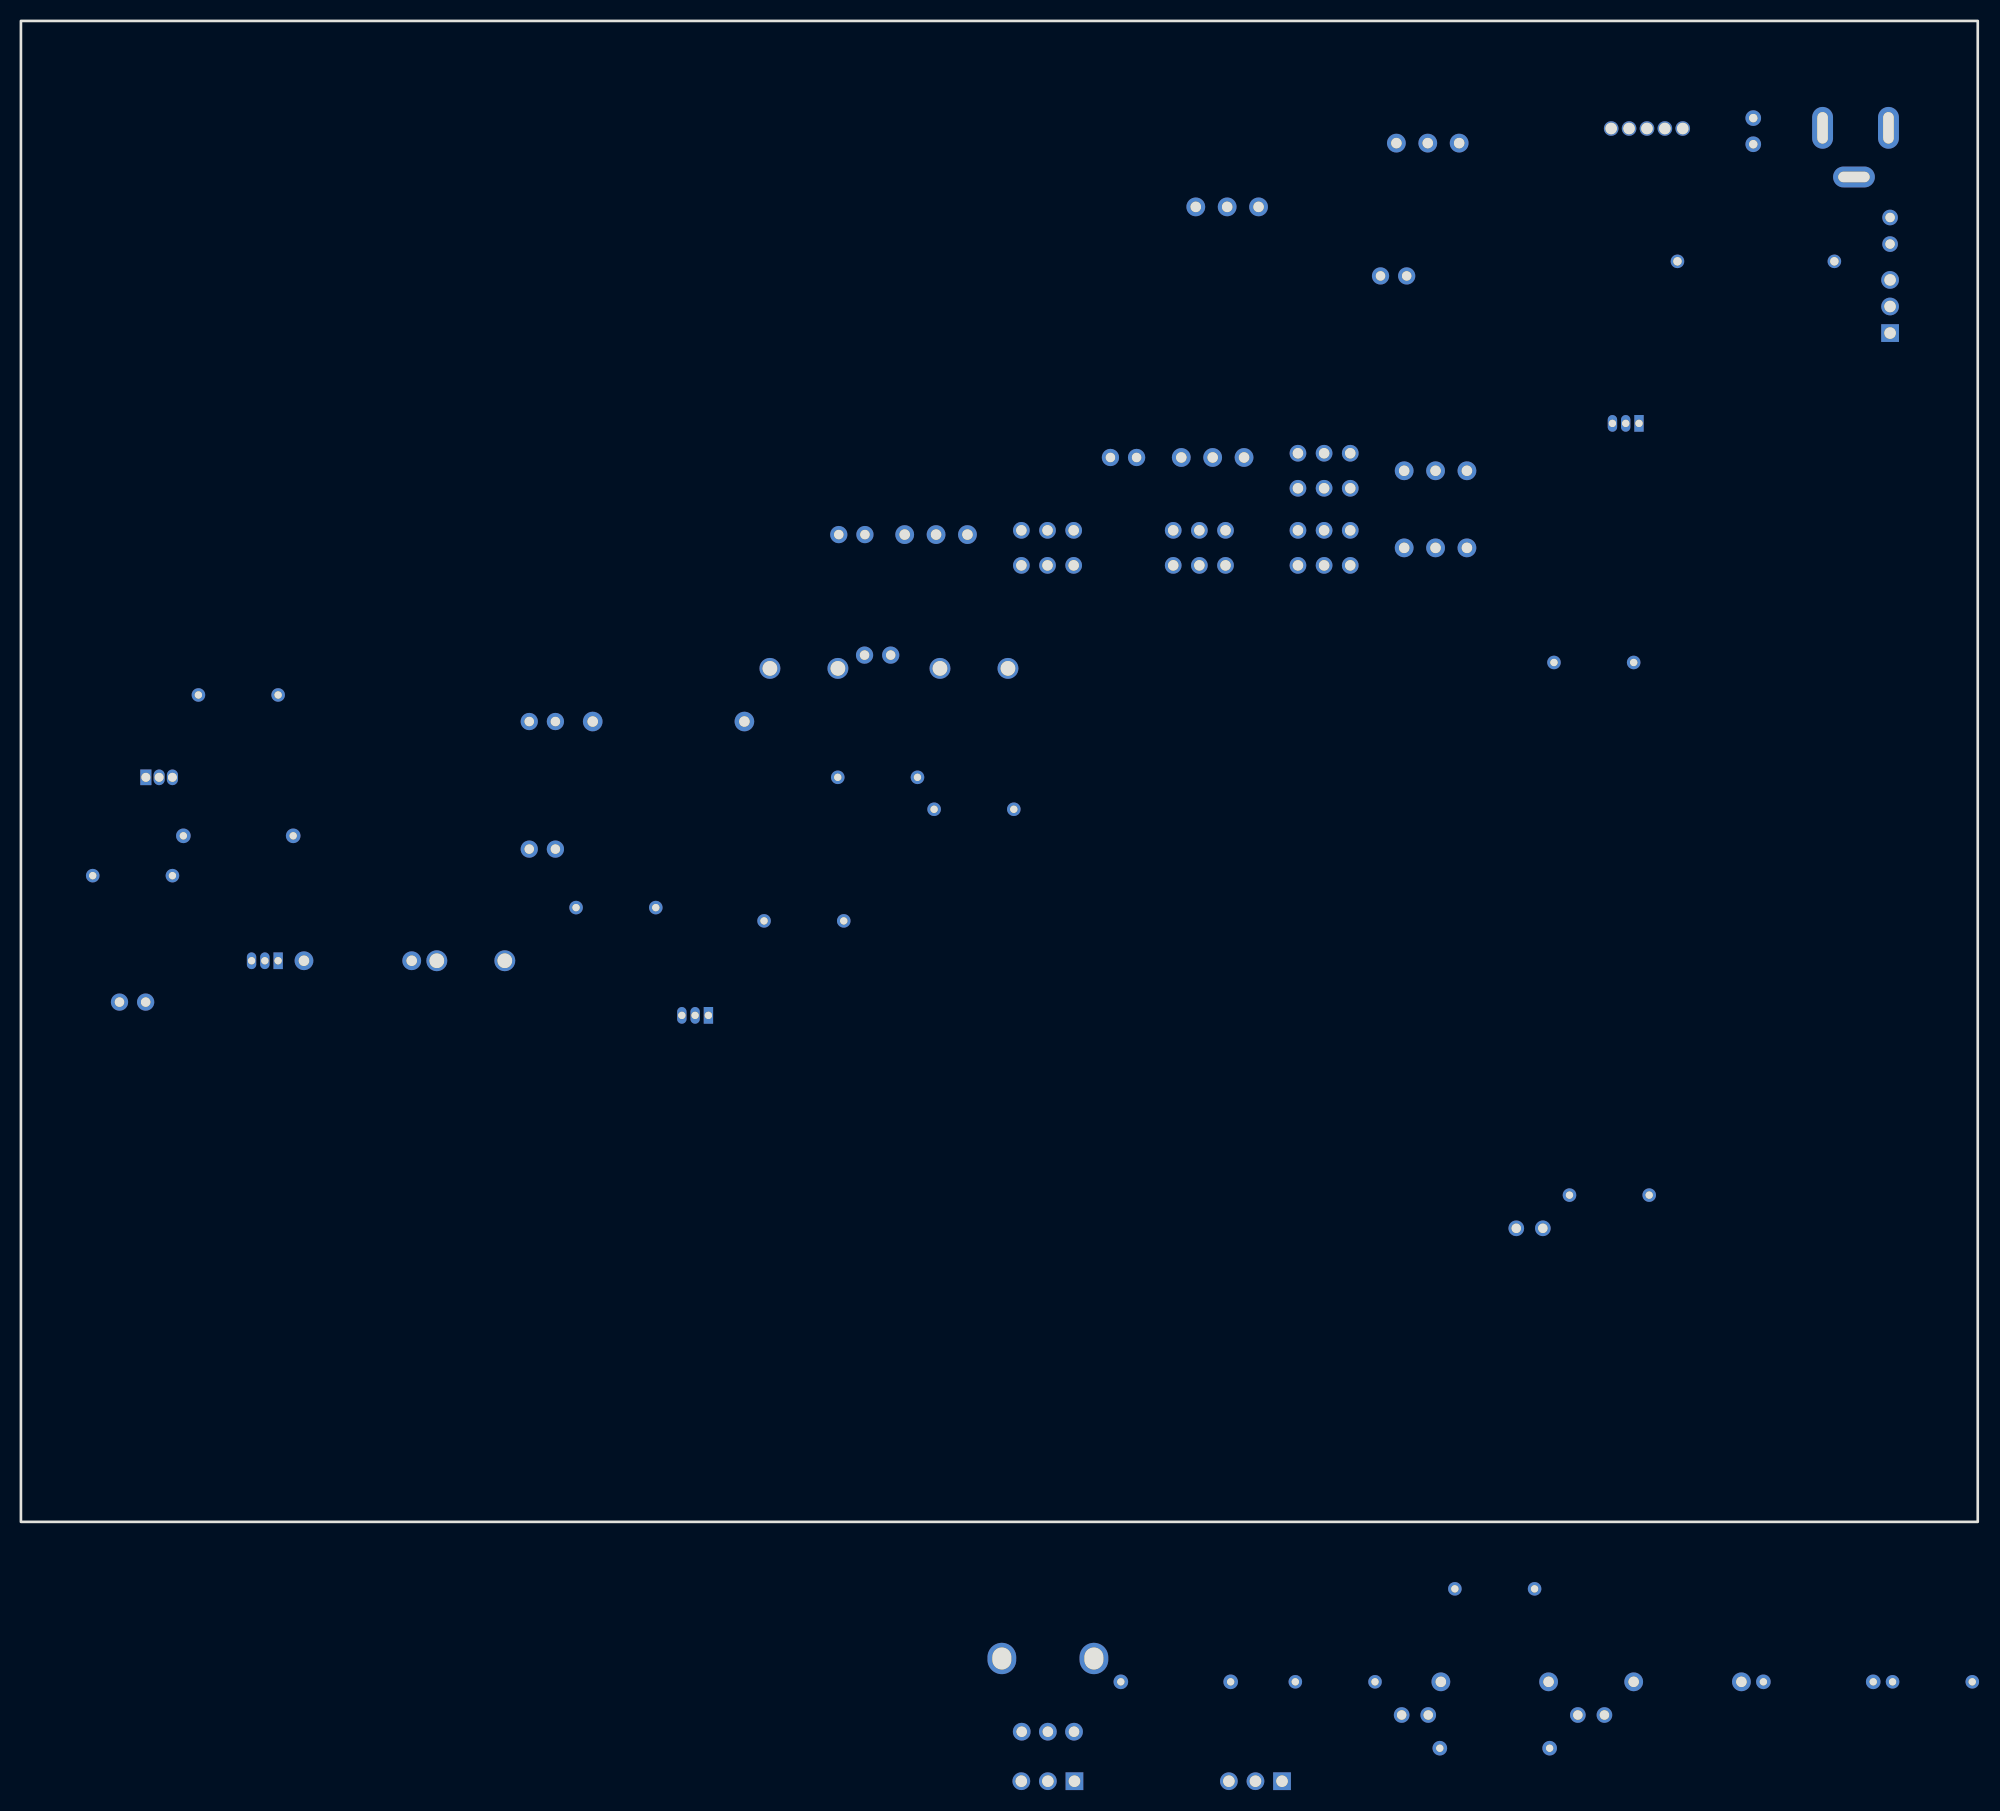
[diagram p5: board, bottom side, seen from below]

Outline 187.07 x 143.51 mm; copper layers: Top Layer, Bottom Layer. Coordinates in mm from the lower left corner of the outline.
Outline path: rectangle 0,143.51 187.07,0
Stack: Top Layer 0.035mm / Dielectric1 1.51mm FR4 er 4.5 / Bottom Layer 0.035mm

## Design rules (mm)
template: JLCPCB Capability(Two Layers Board)
spacing copperThickness1oz (default): track to track 0.102, other pairs 0.152 to 0.3
spacing copperThickness2oz: track to track 0.203, other pairs 0.152 to 0.3
track width copperThickness1oz (default): min 0.127, default 0.254, max 2.54
track width copperThickness2oz: min 0.203, default 0.254, max 2.54
differential pair differentialPair (default): width min 0.127, default 0.254, max 2.54; gap min 0.152, default 0.152
via viaSize (default): diameter min 0.5, default 0.61, max 10; hole min 0.3, default 0.305, max 6.3

## Placement (name value [footprint] x y rotation side)
ONOUT1  PH2.54-1X2P-H25  [HDR-TH_2P-P2.54-V-M-4]  42.85 28.07 0 top
ONOUT2  PH2.54-1X2P-H25  [HDR-TH_2P-P2.54-V-M-4]  36.96 -18.47 0 top
ONOUT3  PH2.54-1X2P-H25  [HDR-TH_2P-P2.54-V-M-4]  53.8 -18.47 0 top
ONOUT4  PH2.54-01-03PZD  [HDR-TH_3P-P2.54-V-M]  69.05 -24.8 0 top
ONOUT5  PH2.54-01-03PZD  [HDR-TH_3P-P2.54-V-M]  88.9 -24.8 0 top
ONPOT1  10kΩ  [RES-ADJ-TH_RK09D1130C3C]  88.9 -16.56 0 top
ONR1  1kΩ  [RES-TH_BD2.3-L3.7-P7.70-D0.9]  35.22 31.24 0 top
ONR2  1kΩ  [RES-TH_BD2.3-L3.7-P7.70-D0.9]  4.33 -15.29 0 top
ONR3  3.3kΩ  [RES-TH_BD2.3-L6.5-P10.50-D0.5]  15.24 -15.29 0 top
ONR4  10kΩ  [RES-TH_BD2.3-L6.3-P10.30-D0.6]  27.74 -15.29 0 top
ONR5  1kΩ  [RES-TH_BD2.3-L3.7-P7.70-D0.9]  46.18 -6.4 0 top
ONR6  10kΩ  [RES-TH_BD2.3-L6.3-P10.30-D0.6]  46.18 -15.29 0 top
ONR7  3.3kΩ  [RES-TH_BD2.3-L6.5-P10.50-D0.5]  46.18 -21.64 0 top
ONR8  1kΩ  [RES-TH_BD2.3-L3.7-P7.70-D0.9]  61.43 -15.29 0 top
ONR9  3.3kΩ  [RES-TH_BD2.3-L6.5-P10.50-D0.5]  76.67 -15.29 0 top
Q1  2N4401052  [TO-92-3_L4.9-W3.7-P1.27-L]  33.66 105.03 0 top
Q2  2N4401052  [TO-92-3_L4.9-W3.7-P1.27-L]  122.62 48.43 0 top
Q3  2N4401052  [TO-92-3_L4.9-W3.7-P1.27-L]  163.75 53.65 0 top
Q4  2N3906  [TO-92-3_L4.8-W3.7-P1.27-R-1]  173.86 71.19 0 top
R2  1kΩ  [RES-TH_BD2.3-L3.7-P7.70-D0.9]  95.96 68.14 0 top
R3  1kΩ  [RES-TH_BD2.3-L3.7-P7.70-D0.9]  112.22 57.46 0 top
R4  1kΩ  [RES-TH_BD2.3-L3.7-P7.70-D0.9]  130.19 58.73 0 top
R5  1kΩ  [RES-TH_BD2.3-L3.7-P7.70-D0.9]  105.17 71.19 0 top
R6  3.3kΩ  [RES-TH_BD2.3-L6.5-P10.50-D0.5]  166.29 65.6 0 top
R7  1kΩ  [RES-TH_BD2.3-L3.7-P7.70-D0.9]  166.29 79.06 0 top
R8  1kΩ  [RES-TH_BD2.3-L3.7-P7.70-D0.9]  176.4 61.79 0 top
R1000  1kΩ  [RES-TH_BD2.3-L3.7-P7.70-D0.9]  36.7 82.17 0 top
SW1  KH-SS12F17-G5  [SW-TH_KH-SS12F17-G5]  71.75 125.73 0 top
SW2  KH-SS12F17-G5  [SW-TH_KH-SS12F17-G5]  52.58 131.83 0 top
SW3  MSS22D18G2 125  [SW-TH_SHOU_MSS22D18G2]  62.49 100.5 0 top
SW4  KH-SS12F17-G5  [SW-TH_KH-SS12F17-G5]  51.83 100.5 0 top
SW5  KH-SS12F17-G5  [SW-TH_KH-SS12F17-G5]  73.14 101.77 0 top
SW6  MSS22D18G2 125  [SW-TH_SHOU_MSS22D18G2]  62.49 93.13 0 top
SW7  KH-SS12F17-G5  [SW-TH_KH-SS12F17-G5]  51.83 93.13 0 top
SW8  KH-SS12F17-G5  [SW-TH_KH-SS12F17-G5]  99.58 94.4 0 top
SW9  MSS22D18G2 125  [SW-TH_SHOU_MSS22D18G2]  74.41 93.13 0 top
SW10  MSS22D18G2 125  [SW-TH_SHOU_MSS22D18G2]  88.93 93.13 0 top
SW11  TSA36111-050D331DE  [SW-TH_L6.0-W3.5-P6.50]  95.96 81.6 0 top
SW12  TSA36111-050D331DE  [SW-TH_L6.0-W3.5-P6.50]  112.22 81.6 0 top
SW13  TSA36111-050D331DE  [SW-TH_L6.0-W3.5-P6.50]  144.06 53.65 0 top
U1  204-10SDRD/S530-A3/F182-68  [LED-TH_BD4.0-P2.50-RD]  55.84 119.13 0 top
U2  204-10SDRD/S530-A3/F182-68  [LED-TH_BD4.0-P2.50-RD]  81.66 101.77 0 top
U3  204-10SDRD/S530-A3/F182-68  [LED-TH_BD4.0-P2.50-RD]  107.64 94.4 0 top
U6  204-10SDRD/S530-A3/F182-68  [LED-TH_BD4.0-P2.50-RD]  105.17 82.87 0 top
U7  204-10SDRD/S530-A3/F182-68  [LED-TH_BD4.0-P2.50-RD]  137.22 64.33 0 top
U8  10uH  [IND-TH_BD4.0-L10.5-P14.50-D0.6]  125.16 76.52 0 top
U9  204-10SDRD/S530-A3/F182-68  [LED-TH_BD4.0-P2.50-RD]  137.22 76.52 0 top
U12  10kΩ  [RES-TH_BD2.3-L6.3-P10.30-D0.6]  154.86 53.65 0 top
U13  204-10SDRD/S530-A3/F182-68  [LED-TH_BD4.0-P2.50-RD]  176.4 49.7 0 top
ZEC1  100uF  [CAP-TH_BD6.0-P2.50-D0.5-FD]  21.46 132.97 90 top
ZEDC1  DC-005-2.5  [DC-IN-TH_DC-005-2.5_C9900097950]  11.68 130.94 0 top
ZEIN1  PH2.54-1X2P-H25  [HDR-TH_2P-P2.54-V-M-4]  8.38 123.44 270 top
ZEL1  100uH  [IND-TH_BD4.0-L11.0-P15.00-D0.6]  21.21 120.52 180 top
ZEOUT1  PH2.54-01-03PZD  [HDR-TH_3P-P2.54-V-M]  8.38 116.21 90 top
ZEU1  LM2576T-3.3  [TO-220-5L_L10.2-W4.5-P1.71-L]  31.62 133.22 0 top

## Footprints (pads in the part's own frame, mm; a bottom-side part is the same pattern mirrored in y, then rotated)
CAP-TH_BD6.0-P2.50-D0.5-FD
  round 1.5 hole 0.8: 1(-1.25,0) 2(1.25,0)
DC-IN-TH_DC-005-2.5_C9900097950
  oval 2x4 hole 1x3: 1(3.15,2.35) 2(-3.15,2.35)
  oval 4x2 hole 3x1: 3(0.15,-2.35)
HDR-TH_2P-P2.54-V-M-4
  round 1.5 hole 0.9: 1(-1.27,0) 2(1.27,0)
HDR-TH_3P-P2.54-V-M
  rect 1.7x1.7 hole 1.1: 1(-2.54,0)
  round 1.7 hole 1.1: 2(0,0) 3(2.54,0)
IND-TH_BD4.0-L10.5-P14.50-D0.6
  round 1.879 hole 1: 1(-7.25,0) 2(7.25,0)
IND-TH_BD4.0-L11.0-P15.00-D0.6
  round 1.3 hole 0.8: 1(-7.5,0) 2(7.5,0)
LED-TH_BD4.0-P2.50-RD
  round 1.651 hole 0.9: 1(-1.25,0) 2(1.25,0)
RES-ADJ-TH_RK09D1130C3C
  round 1.7 hole 1: 1(-2.5,-3.5) 2(0,-3.5) 3(2.5,-3.5)
  oval 2.75x3 hole 1.8x2.1: 4(-4.4,3.5) 5(4.4,3.5)
RES-TH_BD2.3-L3.7-P7.70-D0.9
  round 1.3 hole 0.7: 1(-3.81,0) 2(3.81,0)
RES-TH_BD2.3-L6.3-P10.30-D0.6
  round 1.8 hole 1: 1(-5.15,0) 2(5.15,0)
RES-TH_BD2.3-L6.5-P10.50-D0.5
  round 1.4 hole 0.7: 1(-5.25,0) 2(5.25,0)
SW-TH_KH-SS12F17-G5
  round 1.8 hole 1: 1(-3,0) 2(0,0) 3(3,0)
SW-TH_L6.0-W3.5-P6.50
  round 2 hole 1.4: 1(-3.25,0) 2(3.25,0)
SW-TH_SHOU_MSS22D18G2
  round 1.6 hole 1: 1(-2.5,1.675) 2(0,1.675) 3(2.5,1.675) 4(-2.5,-1.675) 5(0,-1.675) 6(2.5,-1.675)
TO-92-3_L4.8-W3.7-P1.27-R-1
  rect 1.07x1.5 hole 0.85: 1(1.27,0)
  oval 1.07x1.5 hole 0.85: 2(0,0) 3(-1.27,0)
TO-92-3_L4.9-W3.7-P1.27-L
  rect 0.9x1.6 hole 0.7: 1(-1.27,0)
  oval 0.9x1.6 hole 0.7: 2(0,0) 3(1.27,0)
TO-220-5L_L10.2-W4.5-P1.71-L
  round 1.4 hole 1.1: 1(-3.42,0) 2(-1.71,0) 3(0,0) 4(1.71,0) 5(3.42,0)

## Nets
As in the schematic.

Pads without a net: ONPOT1 4 5

## Text on the board
Top Silkscreen Layer: VCC | 3.3V | GND | XVCC | XGND | Voltage I/O
